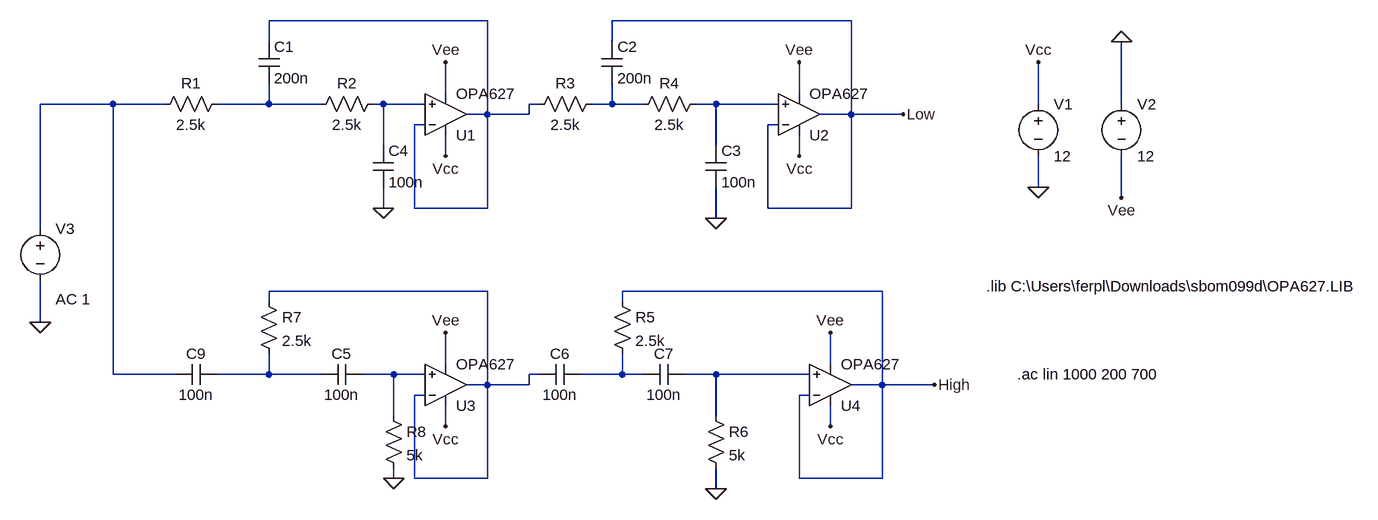
[diagram p0: schematic LR-4.asc]
LR-4.asc, the LTspice schematic file:
Version 4
SHEET 1 1348 680
WIRE -64 -288 -400 -288
WIRE 496 -288 128 -288
WIRE -400 -256 -400 -288
WIRE 128 -256 128 -288
WIRE -128 -176 -128 -224
WIRE 416 -176 416 -224
WIRE -640 -160 -752 -160
WIRE -560 -160 -640 -160
WIRE -400 -160 -400 -192
WIRE -400 -160 -480 -160
WIRE -320 -160 -400 -160
WIRE -224 -160 -240 -160
WIRE -160 -160 -224 -160
WIRE 16 -160 0 -160
WIRE 128 -160 128 -192
WIRE 128 -160 96 -160
WIRE 176 -160 128 -160
WIRE 288 -160 256 -160
WIRE 384 -160 288 -160
WIRE 784 -160 784 -224
WIRE 912 -160 912 -256
WIRE -64 -144 -64 -288
WIRE -64 -144 -96 -144
WIRE 0 -144 0 -160
WIRE 0 -144 -64 -144
WIRE 496 -144 496 -288
WIRE 496 -144 448 -144
WIRE 576 -144 496 -144
WIRE -160 -128 -176 -128
WIRE 384 -128 368 -128
WIRE -224 -96 -224 -160
WIRE 288 -96 288 -160
WIRE -128 -80 -128 -112
WIRE 416 -80 416 -112
WIRE 784 -32 784 -80
WIRE 912 -16 912 -80
WIRE -224 0 -224 -32
WIRE -176 0 -176 -128
WIRE -64 0 -64 -144
WIRE -64 0 -176 0
WIRE 368 0 368 -128
WIRE 496 0 496 -144
WIRE 496 0 368 0
WIRE 288 16 288 -32
WIRE -752 32 -752 -160
WIRE -64 128 -400 128
WIRE 544 128 144 128
WIRE -400 144 -400 128
WIRE 144 144 144 128
WIRE -752 176 -752 112
WIRE -128 240 -128 192
WIRE 464 240 464 192
WIRE -640 256 -640 -160
WIRE -544 256 -640 256
WIRE -400 256 -400 224
WIRE -400 256 -480 256
WIRE -320 256 -400 256
WIRE -208 256 -256 256
WIRE -160 256 -208 256
WIRE 16 256 0 256
WIRE 144 256 144 224
WIRE 144 256 80 256
WIRE 176 256 144 256
WIRE 288 256 240 256
WIRE 432 256 288 256
WIRE -64 272 -64 128
WIRE -64 272 -96 272
WIRE 0 272 0 256
WIRE 0 272 -64 272
WIRE 544 272 544 128
WIRE 544 272 496 272
WIRE 624 272 544 272
WIRE -160 288 -176 288
WIRE 432 288 416 288
WIRE -208 320 -208 256
WIRE 288 320 288 256
WIRE -128 336 -128 304
WIRE 464 336 464 304
WIRE -208 416 -208 400
WIRE -176 416 -176 288
WIRE -64 416 -64 272
WIRE -64 416 -176 416
WIRE 416 416 416 288
WIRE 544 416 544 272
WIRE 544 416 416 416
WIRE 288 432 288 400
FLAG 784 -32 0
FLAG 912 -256 0
FLAG 784 -224 Vcc
FLAG 912 -16 Vee
FLAG -224 0 0
FLAG 288 16 0
FLAG 576 -144 Low
FLAG 416 -80 Vcc
FLAG -128 -80 Vcc
FLAG 416 -224 Vee
FLAG -128 -224 Vee
FLAG -208 416 0
FLAG 288 432 0
FLAG 624 272 High
FLAG 464 336 Vcc
FLAG -128 336 Vcc
FLAG 464 192 Vee
FLAG -128 192 Vee
FLAG -752 176 0
SYMBOL OpAmps\\opamp2 -128 -80 M180
SYMATTR InstName U1
SYMATTR Value OPA627
SYMBOL voltage 784 -176 R0
WINDOW 123 0 0 Left 0
WINDOW 39 0 0 Left 0
SYMATTR InstName V1
SYMATTR Value 12
SYMBOL voltage 912 -176 R0
WINDOW 123 0 0 Left 0
WINDOW 39 0 0 Left 0
SYMATTR InstName V2
SYMATTR Value 12
SYMBOL OpAmps\\opamp2 416 -80 M180
SYMATTR InstName U2
SYMATTR Value OPA627
SYMBOL res -464 -176 R90
WINDOW 0 0 56 VBottom 2
WINDOW 3 32 56 VTop 2
SYMATTR InstName R1
SYMATTR Value 2.5k
SYMBOL res -224 -176 R90
WINDOW 0 0 56 VBottom 2
WINDOW 3 32 56 VTop 2
SYMATTR InstName R2
SYMATTR Value 2.5k
SYMBOL res 112 -176 R90
WINDOW 0 0 56 VBottom 2
WINDOW 3 32 56 VTop 2
SYMATTR InstName R3
SYMATTR Value 2.5k
SYMBOL res 272 -176 R90
WINDOW 0 0 56 VBottom 2
WINDOW 3 32 56 VTop 2
SYMATTR InstName R4
SYMATTR Value 2.5k
SYMBOL cap -416 -256 R0
SYMATTR InstName C1
SYMATTR Value 200n
SYMBOL cap 112 -256 R0
SYMATTR InstName C2
SYMATTR Value 200n
SYMBOL cap 272 -96 R0
SYMATTR InstName C3
SYMATTR Value 100n
SYMBOL cap -240 -96 R0
SYMATTR InstName C4
SYMATTR Value 100n
SYMBOL OpAmps\\opamp2 -128 336 M180
SYMATTR InstName U3
SYMATTR Value OPA627
SYMBOL OpAmps\\opamp2 464 336 M180
SYMATTR InstName U4
SYMATTR Value OPA627
SYMBOL cap -480 240 R90
WINDOW 0 0 32 VBottom 2
WINDOW 3 32 32 VTop 2
SYMATTR InstName C9
SYMATTR Value 100n
SYMBOL cap -256 240 R90
WINDOW 0 0 32 VBottom 2
WINDOW 3 32 32 VTop 2
SYMATTR InstName C5
SYMATTR Value 100n
SYMBOL cap 80 240 R90
WINDOW 0 0 32 VBottom 2
WINDOW 3 32 32 VTop 2
SYMATTR InstName C6
SYMATTR Value 100n
SYMBOL cap 240 240 R90
WINDOW 0 0 32 VBottom 2
WINDOW 3 32 32 VTop 2
SYMATTR InstName C7
SYMATTR Value 100n
SYMBOL res 128 128 R0
SYMATTR InstName R5
SYMATTR Value 2.5k
SYMBOL res 272 304 R0
SYMATTR InstName R6
SYMATTR Value 5k
SYMBOL res -416 128 R0
SYMATTR InstName R7
SYMATTR Value 2.5k
SYMBOL res -224 304 R0
SYMATTR InstName R8
SYMATTR Value 5k
SYMBOL voltage -752 16 R0
WINDOW 123 24 124 Left 2
WINDOW 39 0 0 Left 0
SYMATTR InstName V3
SYMATTR Value ""
SYMATTR Value2 AC 1
TEXT 704 120 Left 2 !.lib C:\\Users\\ferpl\\Downloads\\sbom099d\\OPA627.LIB
TEXT 752 256 Left 2 !.ac lin 1000 200 700

The netlist it stands for:
* LR-4.asc
XU1 N004 N001 Vcc Vee N001 OPA627  ; pins In+ In- V+ V- OUT
V1 Vcc 0 12
V2 0 Vee 12
XU2 N006 Low Vcc Vee Low OPA627  ; pins In+ In- V+ V- OUT
R1 N003 N002 2.5k
R2 N004 N003 2.5k
R3 N005 N001 2.5k
R4 N006 N005 2.5k
C1 N001 N003 200n
C2 Low N005 200n
C3 N006 0 100n
C4 N004 0 100n
XU3 N009 N007 Vcc Vee N007 OPA627  ; pins In+ In- V+ V- OUT
XU4 N011 High Vcc Vee High OPA627  ; pins In+ In- V+ V- OUT
C9 N008 N002 100n
C5 N009 N008 100n
C6 N010 N007 100n
C7 N011 N010 100n
R5 High N010 2.5k
R6 N011 0 5k
R7 N007 N008 2.5k
R8 N009 0 5k
V3 N002 0 AC 1
.lib C:\Users\ferpl\Downloads\sbom099d\OPA627.LIB
.ac lin 1000 200 700
.backanno
.end